# Altium schematic sheet HandBox-KCTW.SchDoc
size A4
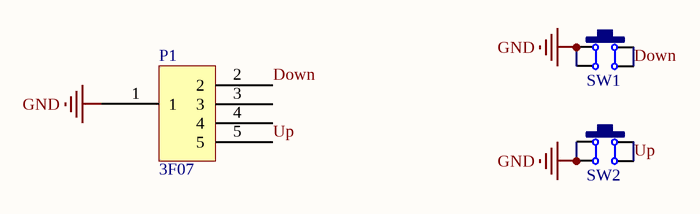
[diagram p0: HandBox-KCTW.SchDoc]

## Parts
P1  3F07  [3F07]
SW1  6x6x5  [TSW SMD-12*12*8]  (value not drawn)
SW2  6x6x5  [TSW SMD-12*12*8]  (value not drawn)

## Nets
GND: P1.1 SW1.1 SW1.4 SW2.1 SW2.4
Down: P1.2 SW1.2 SW1.3
Up: P1.5 SW2.2 SW2.3

Not connected (* = marked no-connect by the designer): P1 3 4

## Library data of the parts
P1 = 3F07: EarPhone3.5
SW1 SW2 = TSW SMD-6x6: 贴片6x6轻触开关; 版权归属: 源创客; BOM名称: 贴片6x6轻触开关; 学习资源: www.ooocke.com